# Altium schematic sheet Sheet2.SchDoc
size A
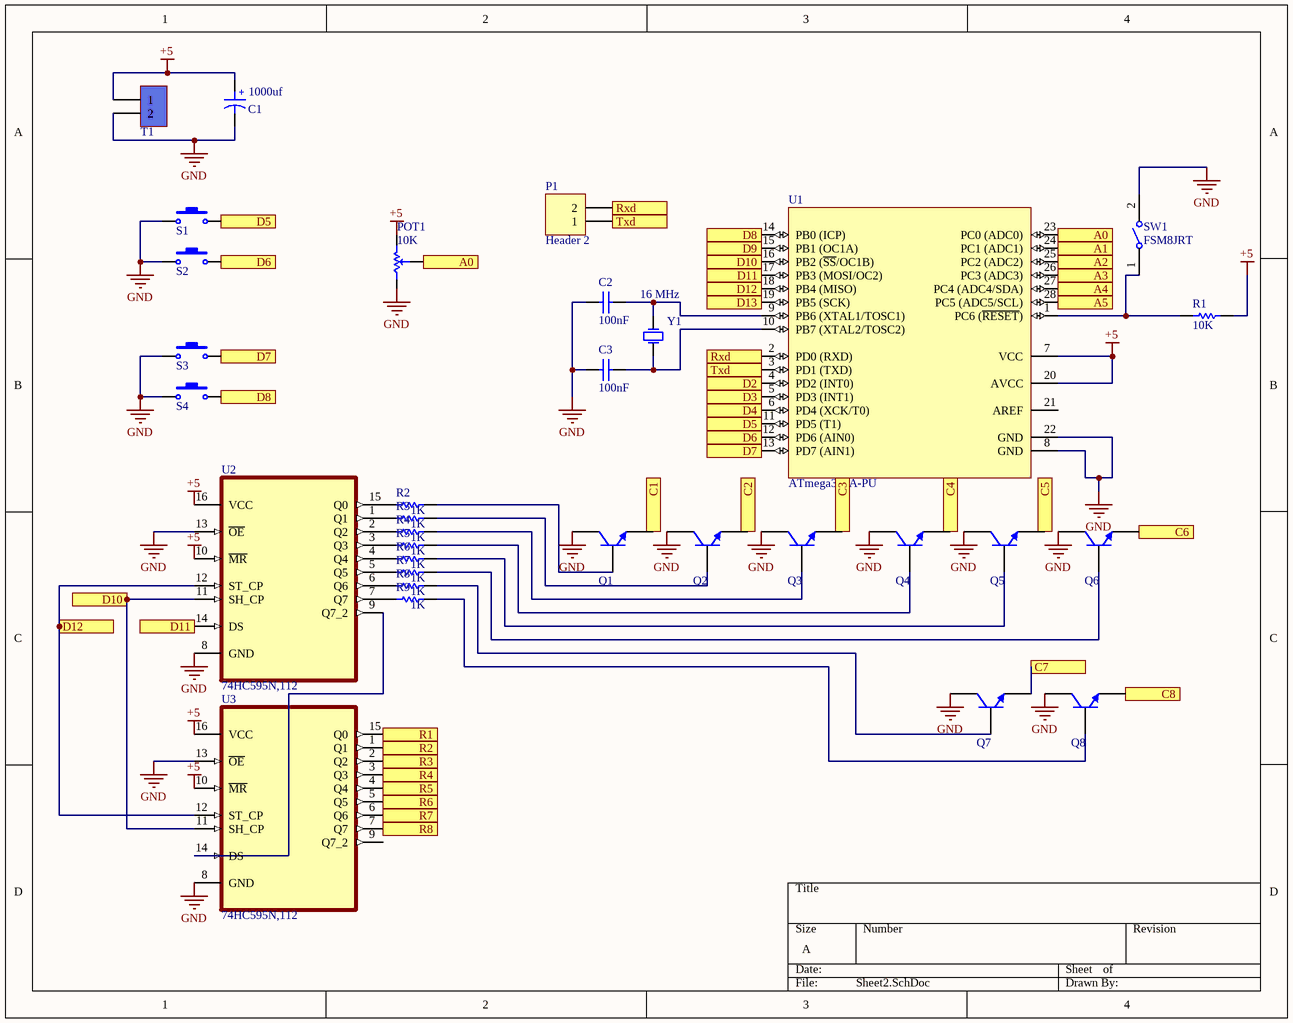
[diagram p0: Sheet2.SchDoc]

## Parts
C1  1000uf  [Cap electrolitic radial 10x20-5]
C2  100nF  [Cap-100nF]
C3  100nF  [Cap-100nF]
P1  Header 2  [HDR1X2]
POT1  10K  [POT]
Q1  BC547  [TO-92 STR]  (value not drawn)
Q2  BC547  [TO-92 STR]  (value not drawn)
Q3  BC547  [TO-92 STR]  (value not drawn)
Q4  BC547  [TO-92 STR]  (value not drawn)
Q5  BC547  [TO-92 STR]  (value not drawn)
Q6  BC547  [TO-92 STR]  (value not drawn)
Q7  BC547  [TO-92 STR]  (value not drawn)
Q8  BC547  [TO-92 STR]  (value not drawn)
R1  10K  [RES-(1/4)]
R2  1K  [RES1206]
R3  1K  [RES1206]
R4  1K  [RES1206]
R5  1K  [RES1206]
R6  1K  [RES1206]
R7  1K  [RES1206]
R8  1K  [RES1206]
R9  1K  [RES1206]
S1  Switch PB  [Switch - Push to On]  (value not drawn)
S2  Switch PB  [Switch - Push to On]  (value not drawn)
S3  Switch PB  [Switch - Push to On]  (value not drawn)
S4  Switch PB  [Switch - Push to On]  (value not drawn)
SW1  FSM8JRT  [TE_FSM8JRT]
T1  Terminal  [Terminal 1*2]  (value not drawn)
U1  ATmega328A-PU  [28P3]
U2  74HC595N,112  [DIP254P762X420-16]
U3  74HC595N,112  [DIP254P762X420-16]
Y1  16 MHz  [XTAL 16MHZ]

## Ports
A0, A1, A2, A3, A4, A5, C1, C2, C3, C4, C5, C6, C7, C8, D2, D3, D4, D5, D6, D7, D8, D9, D10, D11, D12, D13, R1, R2, R3, R4, R5, R6, R7, R8, Rxd, Txd

## Nets
+5: C1.1 POT1.2(CW) R1.2 T1.1 U1.7(VCC) U1.20(AVCC) U2.10(~{MR}) U2.16(VCC) U3.10(~{MR}) U3.16(VCC)
GND: C1.2 C2.2 C3.2 POT1.1(CCW) Q1.1(C) Q2.1(C) Q3.1(C) Q4.1(C) Q5.1(C) Q6.1(C) Q7.1(C) Q8.1(C) S1.1 S2.1 S3.1 S4.1 SW1.2 T1.2 U1.8(GND) U1.22(GND) U2.8(GND) U2.13(~{OE}) U3.8(GND) U3.13(~{OE})
A0: POT1.3(SetPoint) U1.23(PC0_(ADC0)) ; port A0
A1: U1.24(PC1_(ADC1)) ; port A1
A2: U1.25(PC2_(ADC2)) ; port A2
A3: U1.26(PC3_(ADC3)) ; port A3
A4: U1.27(PC4_(ADC4/SDA)) ; port A4
A5: U1.28(PC5_(ADC5/SCL)) ; port A5
C1: Q1.3(E) ; port C1
C2: Q2.3(E) ; port C2
C3: Q3.3(E) ; port C3
C4: Q4.3(E) ; port C4
C5: Q5.3(E) ; port C5
C6: Q6.3(E) ; port C6
C7: Q7.3(E) ; port C7
C8: Q8.3(E) ; port C8
D2: U1.4(PD2_(INT0)) ; port D2
D3: U1.5(PD3_(INT1)) ; port D3
D4: U1.6(PD4_(XCK/T0)) ; port D4
D5: S1.2 U1.11(PD5_(T1)) ; port D5
D6: S2.2 U1.12(PD6_(AIN0)) ; port D6
D7: S3.2 U1.13(PD7_(AIN1)) ; port D7
D8: S4.2 U1.14(PB0_(ICP)) ; port D8
D9: U1.15(PB1_(OC1A)) ; port D9
D10: U1.16(PB2_(~{SS}/OC1B)) U2.11(SH_CP) U3.11(SH_CP) ; port D10
D11: U1.17(PB3_(MOSI/OC2)) U2.14(DS) ; port D11
D12: U1.18(PB4_(MISO)) U2.12(ST_CP) U3.12(ST_CP) ; port D12
D13: U1.19(PB5_(SCK)) ; port D13
R1: U3.15(Q0) ; port R1
R2: U3.1(Q1) ; port R2
R3: U3.2(Q2) ; port R3
R4: U3.3(Q3) ; port R4
R5: U3.4(Q4) ; port R5
R6: U3.5(Q5) ; port R6
R7: U3.6(Q6) ; port R7
R8: U3.7(Q7) ; port R8
Rxd: P1.2 U1.2(PD0_(RXD)) ; port Rxd
Txd: P1.1 U1.3(PD1_(TXD)) ; port Txd
NetC2_1: C2.1 U1.9(PB6_(XTAL1/TOSC1)) Y1.2(OSC2)
NetC3_1: C3.1 U1.10(PB7_(XTAL2/TOSC2)) Y1.1(OSC1)
NetQ1_2: Q1.2(B) R2.1
NetQ2_2: Q2.2(B) R3.1
NetQ3_2: Q3.2(B) R4.1
NetQ4_2: Q4.2(B) R5.1
NetQ5_2: Q5.2(B) R6.1
NetQ6_2: Q6.2(B) R7.1
NetQ7_2: Q7.2(B) R8.1
NetQ8_2: Q8.2(B) R9.1
NetR1_1: R1.1 SW1.1 U1.1(PC6_(~{RESET}))
NetR2_2: R2.2 U2.15(Q0)
NetR3_2: R3.2 U2.1(Q1)
NetR4_2: R4.2 U2.2(Q2)
NetR5_2: R5.2 U2.3(Q3)
NetR6_2: R6.2 U2.4(Q4)
NetR7_2: R7.2 U2.5(Q5)
NetR8_2: R8.2 U2.6(Q6)
NetR9_2: R9.2 U2.7(Q7)
NetU2_9: U2.9(Q7_2) U3.14(DS)

Not connected (* = marked no-connect by the designer): U1 21(AREF); U3 9(Q7_2)

## Notes on the sheet
- (in symbol Cap electrolitic radial 10x21) +

## Library data of the parts
C1 = Cap electrolitic radial 10x21: Cap electrolitic radial; Part. No: 100U/50V; Designer: Abbas Basereh; Data: 16-12-2016
C2 C3 = CAP CERAMIC TOTAL SIZE: CAP Ceramic Total; Designer: Ali Hafizi
P1 = Header 2: Header, 2-Pin; LatestRevisionDate: 17-Jul-2002; LatestRevisionNote: Re-released for DXP Platform.; Publisher: Altium Limited
POT1 = POT: Variable Resistor; Value: 10K
Q1-Q8 = BC547: NPN General-purpose Transistor; Designer: Abbas Basereh; Desc.: Plastic Medium-Power. Silicon NPN Transistors; Data: 27-12-2016
R1 = RES DIP PACKAGE: TOTAL DIP RESISTOR PACK; Designer: Ali Hafizi
R2-R9 = RES SMD PACKAGE: TOTAL SMD RESISTOR PACK; Designer: Abbas Basereh; Desc.: RES SMD PAKAGES; Data: 2017-3-10
S1-S4 = Switch PB: Push Button Switch
SW1 = FSM8JRT: Switch Tactile OFF _ON_ SPST Round Button PC Pins 0.05A 12VDC 1.57N Thru-Hole Radial Tape; Contact_Current_Rating: 50 mA; MF: TE Connectivity; Configuration_Pole-Throw: Single Pole - Single Throw; Availability: Unavailable; Price: None; SnapEDA_Link: https://www.snapeda.com/parts/FSM8JRT/TE%20Connectivity%20ALCOSWITCH%20Switches/view-part/226999/?ref=snap; EU_RoHS_Compliance: Compliant; Value: *; Package: None; TE_purchase_URL: https://www.te.com/usa-en/product-147694-1.html?te_bu=Cor&te_type=disp&te_campaign=seda_glo_cor-seda-global-disp-prtnr-fy19-seda-model-bom-cta_sma-317_1&elqCampaignId=32493; MP: FSM8JRT
T1 = Terminal 1*2: Terminal 2 Pin 250VAC 16A; Designer: Seyed Mohsen Ghasemain; E-mail: picpars@gmail.com; ComponentLinkURL: www.picpars.com
U1 = ATmega8A-PU: 8-bit AVR Microcontroller, 8KB Flash, 512 Bytes EEPROM, 1KB SRAM, 28-pin PDIP, Industrial Grade (-40°C to 85°C); Published: 2017-1-5; DatasheetVersion: 2017-1-5; PackageVersion: 2017-1-5; PackageReference: 28P3; Publisher: Abbas Basereh; PackageDescription: 28-lead (0.300"/7.62mm Wide) Plastic Dual Inline Package (PDIP); Supplier 1: Digi-Key; Supplier Part Number 1: ATMEGA8A-PU-ND; Supplier 2: Farnell; Supplier Part Number 2: 1748534; Supplier 3: Mouser; Supplier Part Number 3: 556-ATMEGA8A-PU; ComponentLink1Description: Manufacturer Link; ComponentLink1URL: http://www.atmel.com/products/avr/default.asp?; ComponentLink2Description: ATmega8A Datasheet; ComponentLink2URL: http://www.atmel.com/dyn/resources/prod_documents/doc8159.pdf; ComponentLink3Description: ATmega8A Summary; ComponentLink3URL: http://www.atmel.com/dyn/resources/prod_documents/8159S.pdf; ComponentLink4Description: Atmel.com Home; ComponentLink4URL: http://www.atmel.com
U2 U3 = 74HC595N,112: Shift Shift Register 1 Element 8 Bit 16-DIP; MF: NXP USA; DigiKey-Purchase-URL: https://snapeda.com/shop?store=DigiKey&id=32067; Value: *; Package: DIP-16 NXP Semiconductors; Price: None; SnapEDA_Link: https://www.snapeda.com/parts/74HC595N,112/NXP%20USA%20Inc./view-part/32067/?ref=snap; Availability: Unavailable; MP: 74HC595N,112
Y1 = XTAL: XTAL Crystal; Designer: ABBAS BASEREH; Value: 12 MHz; Design Date: 2017-1-3; ComponentLink1Description: Datasheet; ComponentLink2Description: Reference; Mounting Technology: Surface Mount\Through-Hole; Status: Unreleased